# EasyEDA Pro project SD-Swicharoo.eprj, schematic MicroSD Adapter
Board Name: Board1; Create Date: 2025-08-20; Page Name: P1; Project Name: Swicharoo-Final; Schematic Name: SD Adapter; Update Date: 2025-08-20; Company: EasyEDA.com; Page Size: A4; Version: V1.0
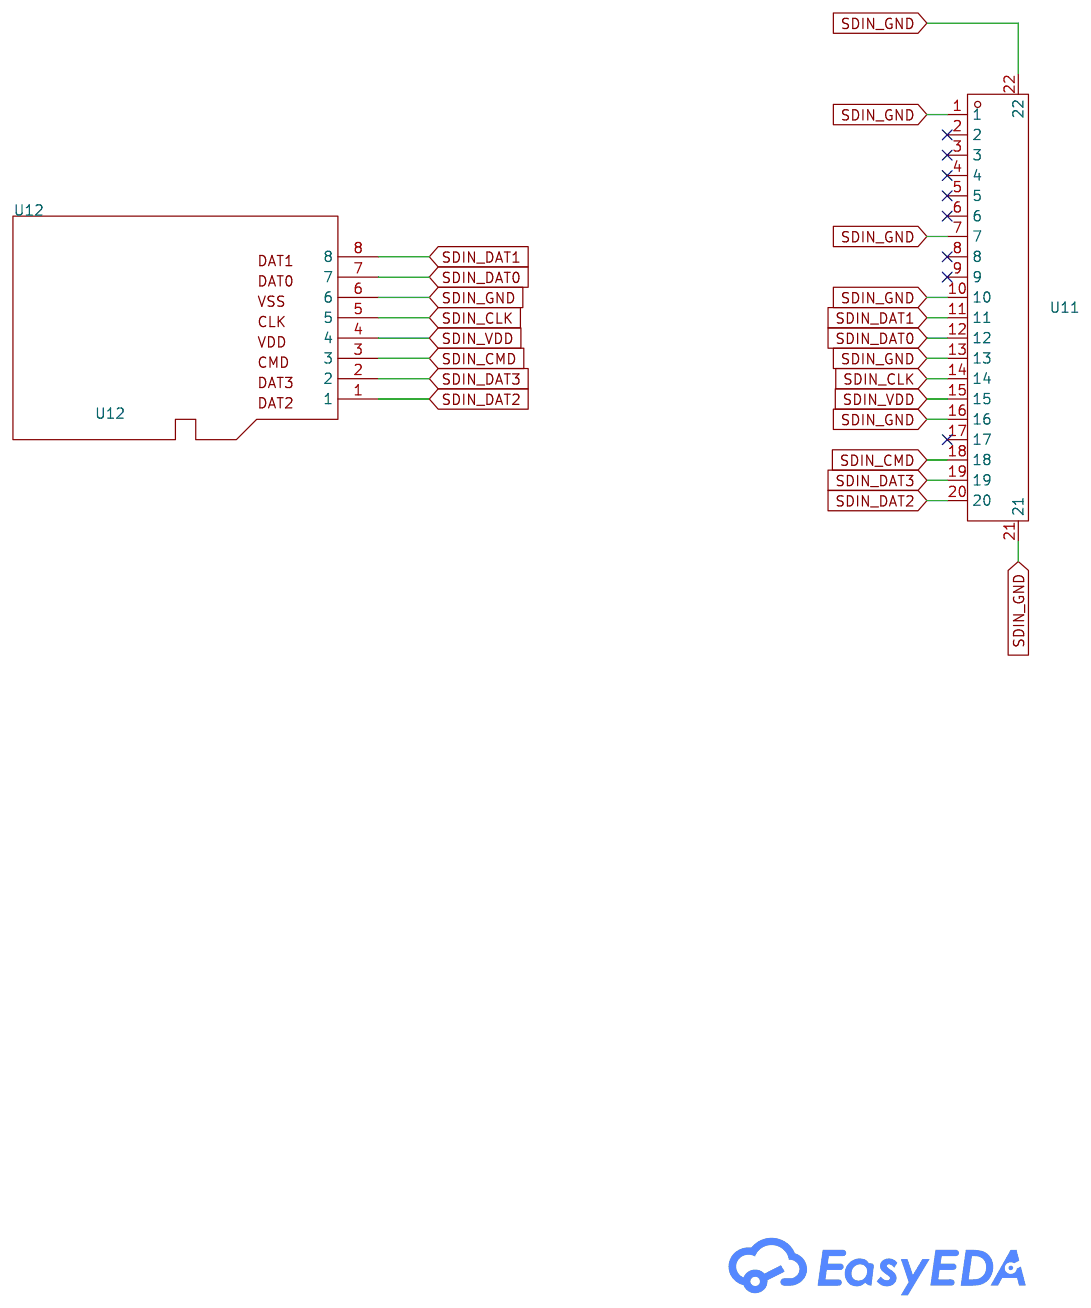
[diagram p1: schematic sheet]

## Parts
U11  05A20L20P  [FPC-SMD_20P-P0.50_L5.9-W14.4]
U12  U12  [MICROSD]

## Library data of the parts
U11 = 05A20L20P: Locking Feature:Flip type Contact Type:Bottom Contact Number of Contacts:20P Pitch:0.5mm Height Above Board:2mm Contact Plating:Tin; Pitch: 0.5mm; Supplier: LCSC; Datasheet: https://atta.szlcsc.com/upload/public/pdf/source/20230308/6F45CD0D9168BB8DDA2BFAAC08B4D6F4.pdf; Contact Type: Bottom Contact; Manufacturer: HanElectricity(瀚源); Supplier Part: C5362157; LCSC Part Name: 翻盖式 下接 P数:20P 间距:0.5mm; Contact Plating: Tin; Locking Feature: Flip type; JLCPCB Part Class: Extended Part; Height Above Board: 2mm; Number of Contacts: 20P; Supplier Footprint: SMD,P=0.5mm
U12 = MicroSD_Board

## Nets
SDIN_CLK: U11.14 U12.5
SDIN_CMD: U11.18 U12.3
SDIN_DAT0: U11.12 U12.7
SDIN_DAT1: U11.11 U12.8
SDIN_DAT2: U11.20 U12.1
SDIN_DAT3: U11.19 U12.2
SDIN_GND: U11.1 U11.7 U11.10 U11.13 U11.16 U11.21 U11.22 U12.6
SDIN_VDD: U11.15 U12.4

Not connected (* = marked no-connect by the designer): U11 2* 3* 4* 5* 6* 8* 9* 17*
